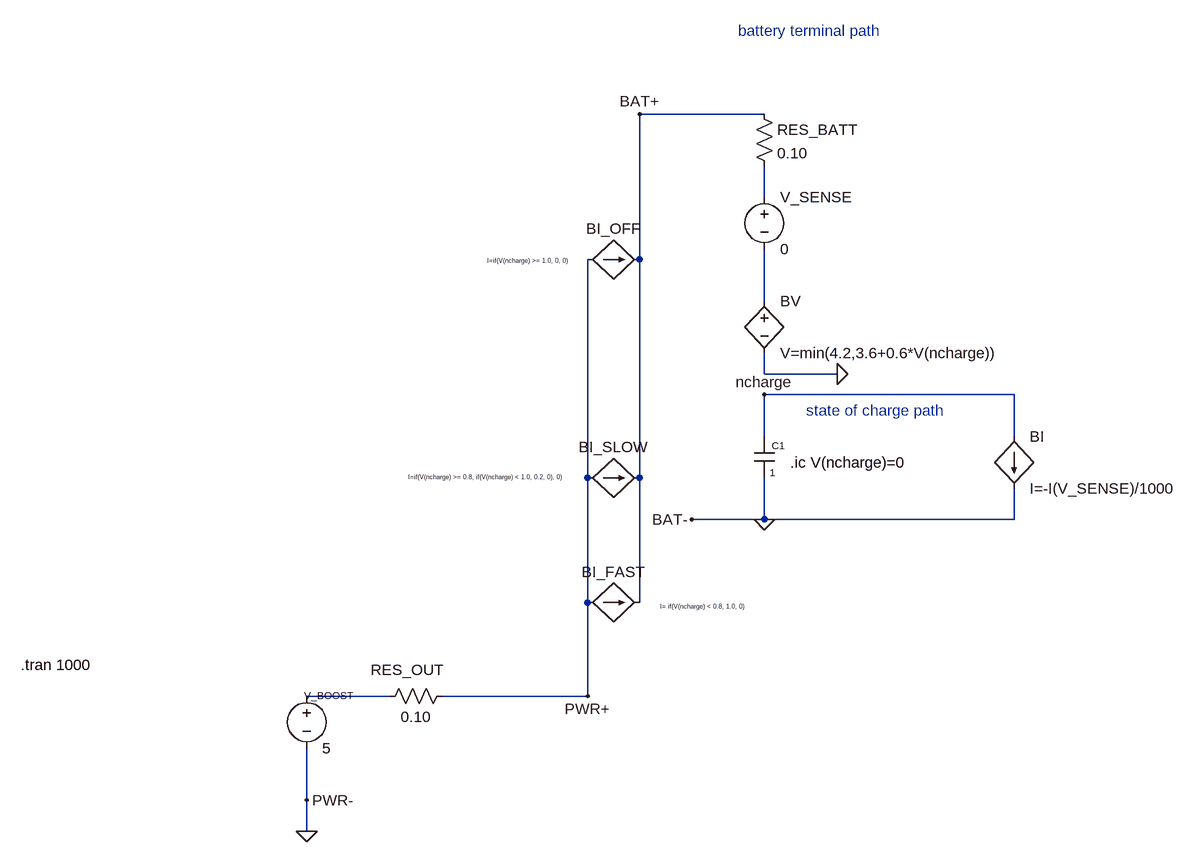
[diagram p0: schematic Manifold.asc]
Manifold.asc, the LTspice schematic file:
Version 4.1
SHEET 1 1636 1280
WIRE 976 144 784 144
WIRE 976 272 976 224
WIRE 784 368 784 144
WIRE 976 432 976 352
WIRE 976 544 976 512
WIRE 1088 544 976 544
WIRE 1360 576 976 576
WIRE 976 640 976 576
WIRE 1360 640 1360 576
WIRE 704 704 704 368
WIRE 784 704 784 368
WIRE 976 768 976 704
WIRE 976 768 864 768
WIRE 1360 768 1360 720
WIRE 1360 768 976 768
WIRE 704 896 704 704
WIRE 784 896 784 704
WIRE 400 1040 272 1040
WIRE 704 1040 704 896
WIRE 704 1040 480 1040
WIRE 272 1200 272 1120
WIRE 272 1248 272 1200
FLAG 704 1040 PWR+
FLAG 272 1248 0
FLAG 272 1200 PWR-
FLAG 784 144 BAT+
FLAG 976 576 ncharge
FLAG 976 768 0
FLAG 864 768 BAT-
FLAG 1088 544 0
SYMBOL bi 704 896 R270
WINDOW 0 32 40 VTop 2
WINDOW 3 1 177 VBottom 0
SYMATTR InstName BI_FAST
SYMATTR Value I= if(V(ncharge) < 0.8, 1.0, 0)
SYMBOL bi 704 704 R270
WINDOW 0 32 40 VTop 2
WINDOW 3 8 -157 VBottom 0
SYMATTR InstName BI_SLOW
SYMATTR Value I=if(V(ncharge) >= 0.8, if(V(ncharge) < 1.0, 0.2, 0), 0)
SYMBOL bi 704 368 R270
WINDOW 0 32 40 VTop 2
WINDOW 3 5 -92 VBottom 0
SYMATTR InstName BI_OFF
SYMATTR Value I=if(V(ncharge) >= 1.0, 0, 0)
SYMBOL voltage 272 1024 R0
WINDOW 0 34 25 Bottom 1
SYMATTR InstName V_BOOST
SYMATTR Value 5
SYMBOL res 496 1024 R90
WINDOW 0 -9 69 VBottom 2
WINDOW 3 32 56 VTop 2
SYMATTR InstName RES_OUT
SYMATTR Value 0.10
SYMBOL bv 976 416 R0
SYMATTR InstName BV
SYMATTR Value V=min(4.2,3.6+0.6*V(ncharge))
SYMBOL res 960 128 R0
SYMATTR InstName RES_BATT
SYMATTR Value 0.10
SYMBOL cap 960 640 R0
WINDOW 0 27 14 Left 1
WINDOW 3 24 56 Left 1
SYMATTR InstName C1
SYMATTR Value 1
SYMBOL bi 1360 640 R0
SYMATTR InstName BI
SYMATTR Value I=-I(V_SENSE)/1000
SYMBOL voltage 976 256 R0
SYMATTR InstName V_SENSE
SYMATTR Value 0
TEXT 1016 680 Left 2 !.ic V(ncharge)=0
TEXT 936 16 Left 2 ;battery terminal path
TEXT 1040 600 Left 2 ;state of charge path
TEXT -168 992 Left 2 !.tran 1000

The netlist it stands for:
* Manifold.asc
BI_FAST PWR+ BAT+ I= if(V(ncharge) < 0.8, 1.0, 0)
BI_SLOW PWR+ BAT+ I=if(V(ncharge) >= 0.8, if(V(ncharge) < 1.0, 0.2, 0), 0)
BI_OFF PWR+ BAT+ I=if(V(ncharge) >= 1.0, 0, 0)
V_BOOST N003 0 5
RES_OUT PWR+ N003 0.10
BV N002 0 V=min(4.2,3.6+0.6*V(ncharge))
RES_BATT BAT+ N001 0.10
C1 ncharge 0 1
BI ncharge 0 I=-I(V_SENSE)/1000
V_SENSE N001 N002 0
.ic V(ncharge)=0
* battery terminal path
* state of charge path
.tran 1000
.backanno
.end